# EAGLE design PCA9306 (EAGLE 7.5.0)
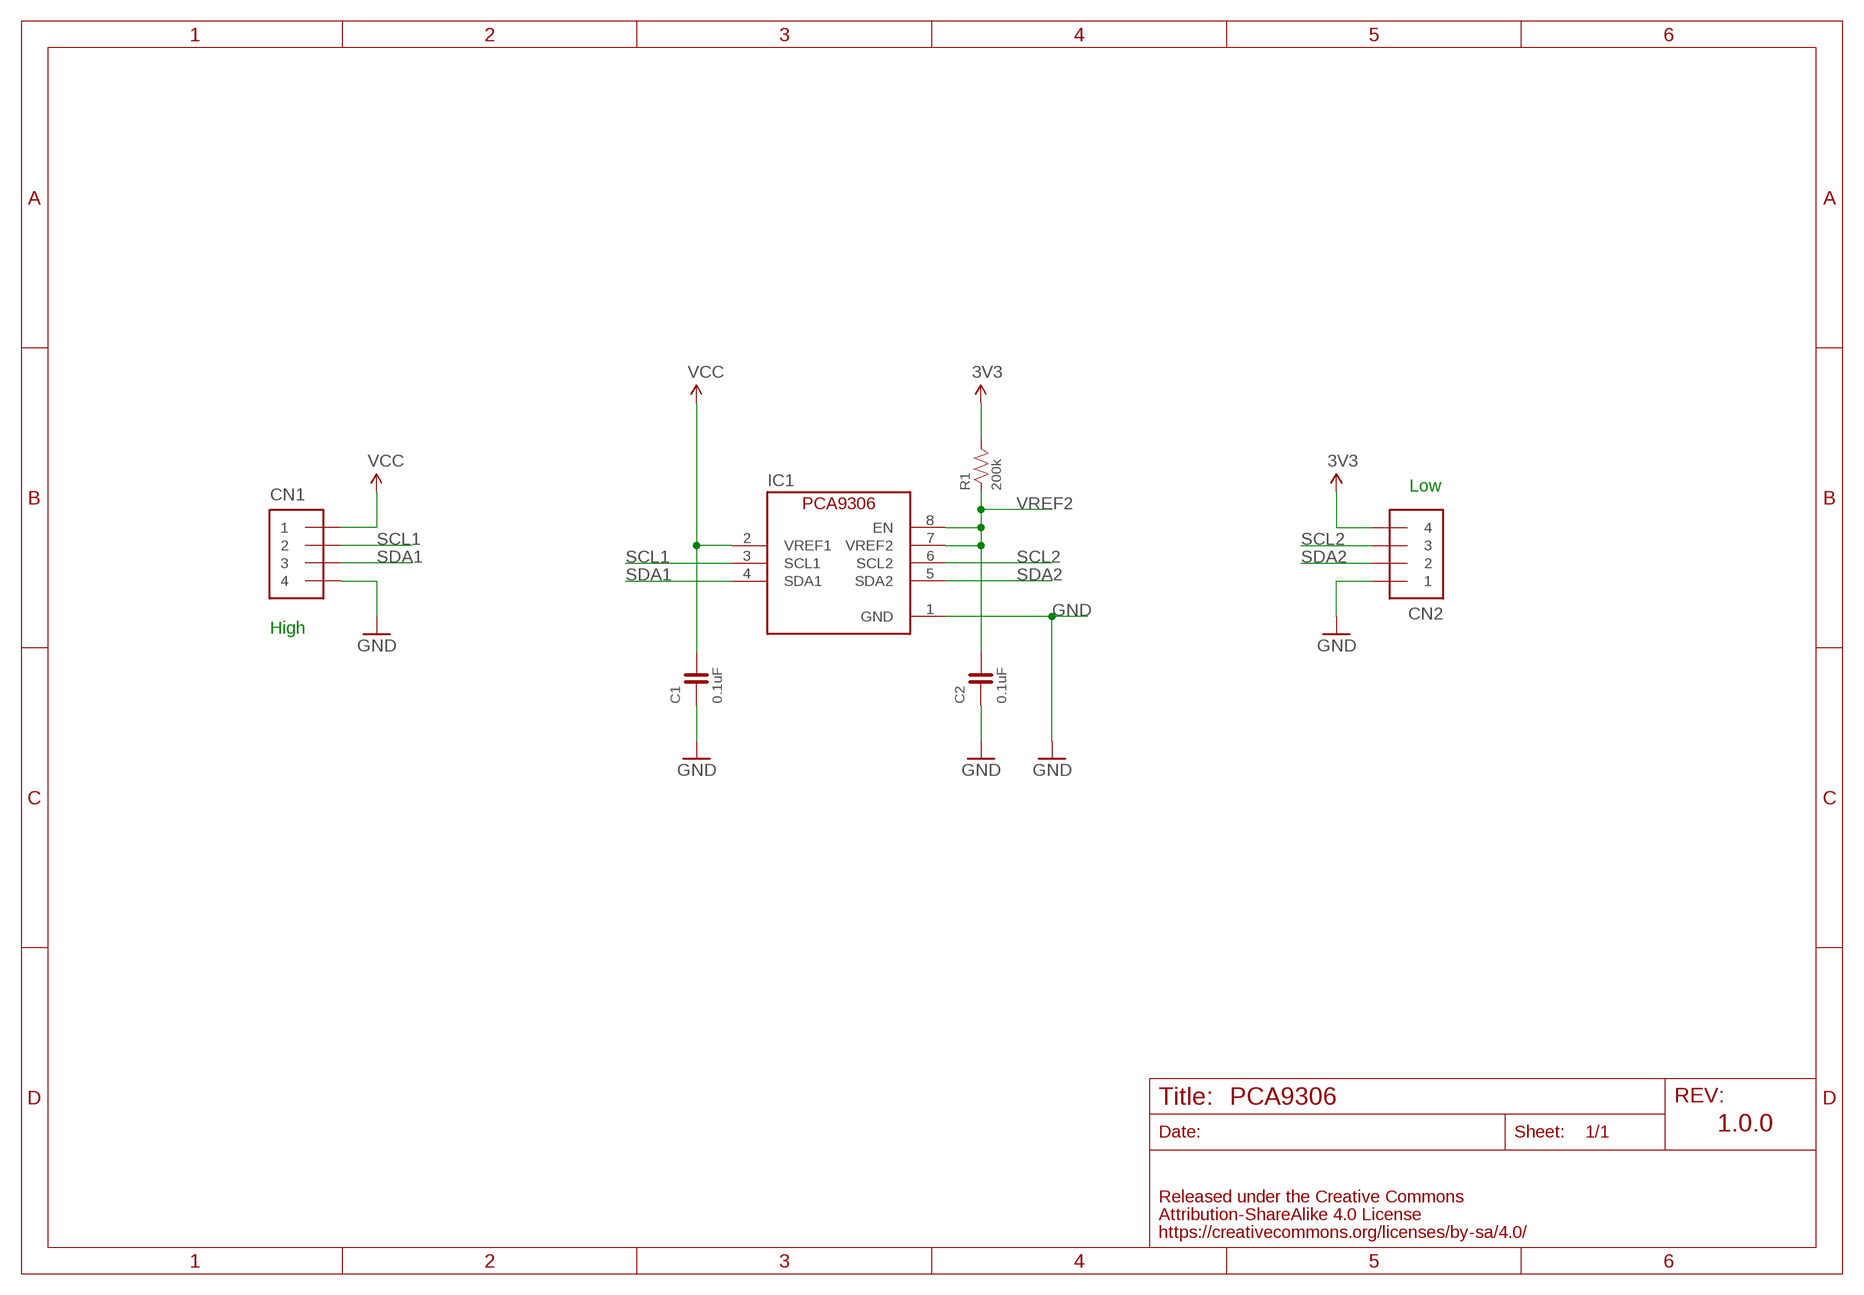
[diagram p0: schematic, sheet 1]

## Parts
C1  0.1uF  CAPACITOR-0603  [0603]
C2  0.1uF  CAPACITOR-0603  [0603]
CN1  PIN_HEADER_1X4  [PIN_1X4_SNEAKY]
CN2  PIN_HEADER_1X4  [PIN_1X4_SNEAKY]
IC1  TI-PCA9306DQE  [TI-PCA9306]
R1  200k  RESISTOR-0603  [0603]

## Nets
3V3: CN2.4 R1.2
GND: C1.1 C2.1 CN1.4 CN2.1 IC1.1(GND)
SCL1: CN1.2 IC1.3(SCL1)
SCL2: CN2.3 IC1.6(SCL2)
SDA1: CN1.3 IC1.4(SDA1)
SDA2: CN2.2 IC1.5(SDA2)
VCC: C1.2 CN1.1 IC1.2(VREF1)
VREF2: C2.2 IC1.7(VREF2) IC1.8(EN) R1.1

## Notes on the sheet
- Low
- High
- 1.0.0

## Library data of the parts
C1 C2 = FaBo-Capacitor:CAPACITOR: CAPACITOR
CN1 CN2 = FaBo-PIN:PIN_HEADER_1X4
IC1 = FaBo-LevelTranslator:TI-PCA9306
R1 = FaBo-Resistors:RESISTOR: RESISTOR

## Board
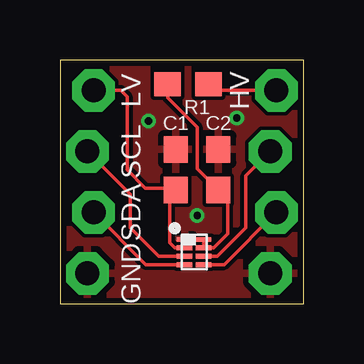
[diagram p1: board, top side]
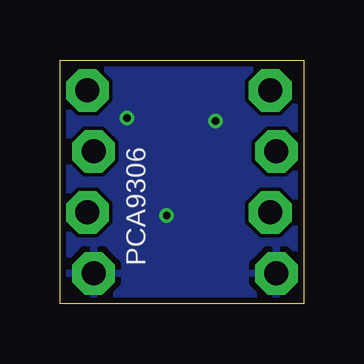
[diagram p2: board, bottom side, seen from below]

Size 10.16 x 10.16 mm. Coordinates in mm from the lower left corner, seen from the top.
Outline: 0,0 10.16,0 10.16,10.16 0,10.16 0,0
Copper layers (1*16): Top 0.035mm / dielectric 1.5mm / Bottom 0.035mm
Design rules "Elecrow_2-layer_eagle_rule": minimum track width 6mil, minimum drill 12mil, track to track 6mil, track to pad 6mil, pad to pad 6mil, via to via 6mil, smd to smd 0mil, copper to edge 10mil, drill to drill 10mil, minimum pad ring 10mil, minimum via ring 6mil, stop-mask expansion 2mil, vias tented up to drill 100mil, thermal gap 10mil

### Footprints (pad centres in the part's own frame; a part is rotated, then mirrored left to right if it is on the bottom)
0603 = smd 1.1 x 1: 1 -0.85,0; 2 0.85,0
PIN_1X4_SNEAKY = drill 1 pad 1.778 octagon: 1 -3.81,0.127; 2 -1.27,-0.127; 3 1.27,0.127; 4 3.81,-0.127
TI-PCA9306 = smd 0.2 x 0.65: 1 -0.525,-0.395; 2 -0.175,-0.395; 3 0.175,-0.395; 4 0.525,-0.395; 5 0.525,0.395; 6 0.175,0.395; 7 -0.175,0.395; 8 -0.525,0.395

### Placement (x,y rotation side)
C1  4.83,5.59 270 top
C2  6.6,5.59 270 top
CN1  1.27,5.08 270 top
CN2  8.89,5.08 90 top
IC1  5.59,2.16 270 top
R1  5.33,9.14 0 top

### Tracks (layer width: path | path; a pad name or v marks a point on that pad's centre or on a via)
3V3
  Top 0.152: CN2.4 6.18,8.89 R1.2
GND  (via drill 0.3)
  other vias: 5.71,3.68 7.37,7.75 3.68,7.62
  pour Bottom: -0.64,-0.64 10.79,-0.64 10.79,10.79 -0.64,10.79
  pour Top: -0.64,-0.64 10.79,-0.64 10.79,10.79 -0.64,10.79
SCL1
  Top 0.152: IC1.3 4.11,1.98 2.92,3.17 2.92,4.57 CN1.2
SCL2
  Top 0.152: IC1.6 6.56,1.98 7.75,3.17 7.75,5.33 CN2.3
SDA1
  Top 0.152: IC1.4 3.57,1.63 CN1.3
SDA2
  Top 0.152: IC1.5 6.84,1.63 CN2.2
VCC
  Top 0.152: CN1.1 2.54,8.89 2.79,8.64 2.79,5.59 3.56,4.83 4.74,4.83 C1.2 4.57,4.48 4.57,2.54 4.78,2.33 IC1.2
VREF2
  Top 0.152: IC1.8 IC1.7 6.4,2.33 6.99,2.92 6.99,4.36 C2.2 5.71,5.63 5.71,7.37 4.48,8.6 R1.1

### Text on the board
tPlace: LV | HV | SCL | SDA | GND
bPlace: PCA9306